# Altium project BLDC_2024.PrjPcb
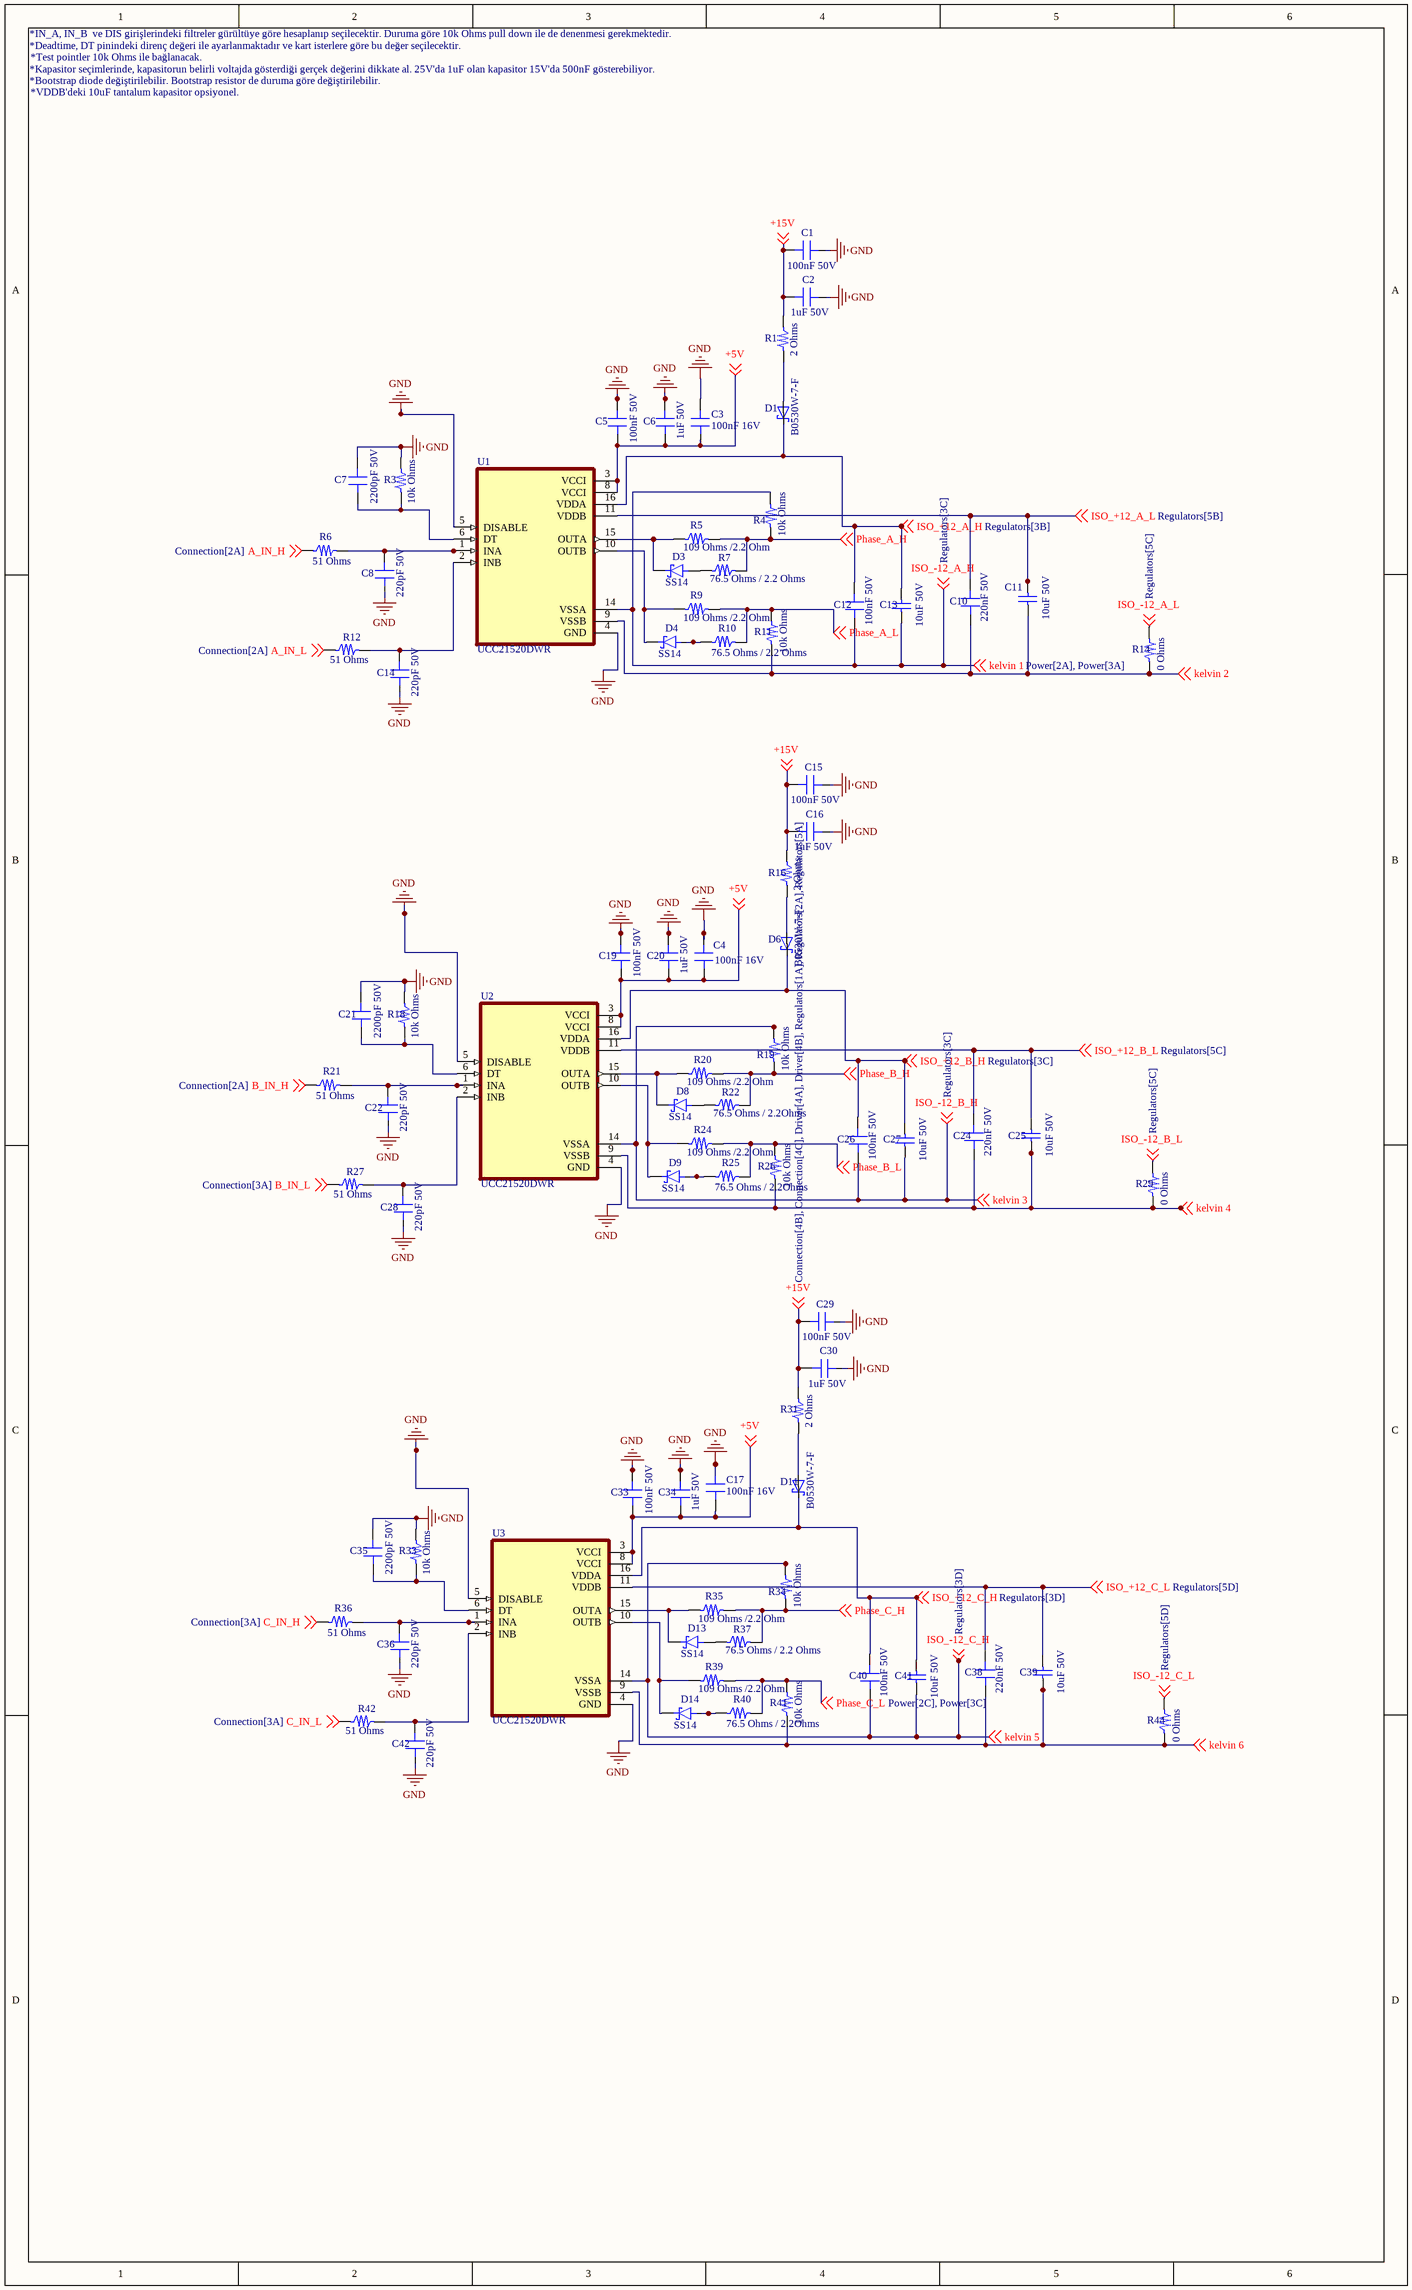
[diagram p0: Driver.SchDoc]
4 sheets, 236 parts. Net scope: flat (ports and power ports of the same name join across sheets).
Board file: PCB3.PcbDoc
Sheets:
  Driver.SchDoc
  Power.SchDoc
  Regulators.SchDoc
  Connection.SchDoc

## Sheet Driver.SchDoc
size 304 x 495 mm; SheetNumber: 1; SheetTotal: 4; SPICEModelCacheATHDNDMS: <root> / <DocumentId>ATHDNDMS</DocumentId> / <CacheFrame Number="0"> / <Model Name="1210_885012009019_2.2nf" Kind="CKT"> / <Text>******* / .subckt 1210_885012009019_2.2nF 1 2 / Rser 1 3 0.0215418747712 / Lser 2 4 2.06777607E-10 / C1 3 4 0.0000000022 / Rpar 3 4 10000000000 / .ends 1210_885012009019_2.2nF</Text> / </Model> / </CacheFrame> / </root>

### Parts
C1  100nF 50V  [0805_CAP]
C2  1uF 50V  [0805_CAP]
C3  100nF 16V  [0805_CAP]
C4  100nF 16V  [0805_CAP]
C5  100nF 50V  [0603_CAP]
C6  1uF 50V  [0603_CAP]
C7  2200pF 50V  [0603_CAP]
C8  220pF 50V  [0603_CAP]
C10  220nF 50V  [0805_CAP]
C11  10uF 50V  [WCAP-CSGP_1210_L3.2W2.5H0.95]
C12  100nF 50V  [0805_CAP]
C13  10uF 50V  [WCAP-CSGP_1210_L3.2W2.5H0.95]
C14  220pF 50V  [0603_CAP]
C15  100nF 50V  [0805_CAP]
C16  1uF 50V  [0805_CAP]
C17  100nF 16V  [0805_CAP]
C19  100nF 50V  [0603_CAP]
C20  1uF 50V  [0603_CAP]
C21  2200pF 50V  [0603_CAP]
C22  220pF 50V  [0603_CAP]
C24  220nF 50V  [0805_CAP]
C25  10uF 50V  [WCAP-CSGP_1210_L3.2W2.5H0.95]
C26  100nF 50V  [0805_CAP]
C27  10uF 50V  [WCAP-CSGP_1210_L3.2W2.5H0.95]
C28  220pF 50V  [0603_CAP]
C29  100nF 50V  [0805_CAP]
C30  1uF 50V  [0805_CAP]
C33  100nF 50V  [0603_CAP]
C34  1uF 50V  [0603_CAP]
C35  2200pF 50V  [0603_CAP]
C36  220pF 50V  [0603_CAP]
C38  220nF 50V  [0805_CAP]
C39  10uF 50V  [WCAP-CSGP_1210_L3.2W2.5H0.95]
C40  100nF 50V  [0805_CAP]
C41  10uF 50V  [WCAP-CSGP_1210_L3.2W2.5H0.95]
C42  220pF 50V  [0603_CAP]
D1  B0530W-7-F  [DO-214AC]
D3  SS14  [SOD3715X145N]
D4  SS14  [SOD3715X145N]
D6  B0530W-7-F  [DO-214AC]
D8  SS14  [SOD3715X145N]
D9  SS14  [SOD3715X145N]
D11  B0530W-7-F  [DO-214AC]
D13  SS14  [SOD3715X145N]
D14  SS14  [SOD3715X145N]
R1  2 Ohms  [0805_RES]
R3  10k Ohms  [0603_RES]
R4  10k Ohms  [0805_RES]
R5  109 Ohms /2.2 Ohm  [0805_RES]
R6  51 Ohms  [0603_RES]
R7  76.5 Ohms / 2.2 Ohms  [0805_RES]
R9  109 Ohms /2.2 Ohm  [0805_RES]
R10  76.5 Ohms / 2.2 Ohms  [0805_RES]
R11  10k Ohms  [0805_RES]
R12  51 Ohms  [0603_RES]
R14  0 Ohms  [0805_RES]
R16  2 Ohms  [0805_RES]
R18  10k Ohms  [0603_RES]
R19  10k Ohms  [0805_RES]
R20  109 Ohms /2.2 Ohm  [0805_RES]
R21  51 Ohms  [0603_RES]
R22  76.5 Ohms / 2.2Ohms  [0805_RES]
R24  109 Ohms /2.2 Ohm  [0805_RES]
R25  76.5 Ohms / 2.2Ohms  [0805_RES]
R26  10k Ohms  [0805_RES]
R27  51 Ohms  [0603_RES]
R29  0 Ohms  [0805_RES]
R31  2 Ohms  [0805_RES]
R33  10k Ohms  [0603_RES]
R34  10k Ohms  [0805_RES]
R35  109 Ohms /2.2 Ohm  [0805_RES]
R36  51 Ohms  [0603_RES]
R37  76.5 Ohms / 2.2 Ohms  [0805_RES]
R39  109 Ohms /2.2 Ohm  [0805_RES]
R40  76.5 Ohms / 2.2Ohms  [0805_RES]
R41  10k Ohms  [0805_RES]
R42  51 Ohms  [0603_RES]
R44  0 Ohms  [0805_RES]
U1  UCC21520DWR  [SOIC127P1030X265-16N]
U2  UCC21520DWR  [SOIC127P1030X265-16N]
U3  UCC21520DWR  [SOIC127P1030X265-16N]

### Nets
GND: C1.1 C2.1 C3.1 C4.1 C5.1 C6.1 C7.2 C8.1 C14.1 C15.1 C16.1 C17.1 C19.1 C20.1 C21.2 C22.1 C28.1 C29.1 C30.1 C33.1 C34.1 C35.2 C36.1 C42.1 R3.2 R18.2 R33.2 U1.4(GND) U1.5(DISABLE) U2.4(GND) U2.5(DISABLE) U3.4(GND) U3.5(DISABLE)
+5V: C3.2 C4.2 C5.2 C6.2 C17.2 C19.2 C20.2 C33.2 C34.2 U1.3(VCCI) U1.8(VCCI) U2.3(VCCI) U2.8(VCCI) U3.3(VCCI) U3.8(VCCI) ; off-sheet +5V
+15V: C1.2 C2.2 C15.2 C16.2 C29.2 C30.2 R1.2 R16.2 R31.2 ; off-sheet +15V
A_IN_H: R6.1 ; off-sheet A_IN_H
A_IN_L: R12.1 ; off-sheet A_IN_L
B_IN_H: R21.1 ; off-sheet B_IN_H
B_IN_L: R27.1 ; off-sheet B_IN_L
C_IN_H: R36.1 ; off-sheet C_IN_H
C_IN_L: R42.1 ; off-sheet C_IN_L
ISO_+12_A_H: C12.1 C13.2 D1.K U1.16(VDDA) ; off-sheet ISO_+12_A_H
ISO_+12_A_L: C10.1 C11.2 U1.11(VDDB) ; off-sheet ISO_+12_A_L
ISO_+12_B_H: C26.1 C27.2 D6.K U2.16(VDDA) ; off-sheet ISO_+12_B_H
ISO_+12_B_L: C24.1 C25.2 U2.11(VDDB) ; off-sheet ISO_+12_B_L
ISO_+12_C_H: C40.1 C41.2 D11.K U3.16(VDDA) ; off-sheet ISO_+12_C_H
ISO_+12_C_L: C38.1 C39.2 U3.11(VDDB) ; off-sheet ISO_+12_C_L
ISO_-12_A_H: C12.2 C13.1 R4.1 U1.14(VSSA) ; off-sheet ISO_-12_A_H, off-sheet kelvin 1  [also labelled kelvin 1]
ISO_-12_A_L: R14.1 ; off-sheet ISO_-12_A_L
ISO_-12_B_H: C26.2 C27.1 R19.1 U2.14(VSSA) ; off-sheet ISO_-12_B_H, off-sheet kelvin 3  [also labelled kelvin 3]
ISO_-12_B_L: R29.1 ; off-sheet ISO_-12_B_L
ISO_-12_C_H: C40.2 C41.1 R34.1 U3.14(VSSA) ; off-sheet ISO_-12_C_H, off-sheet kelvin 5  [also labelled kelvin 5]
ISO_-12_C_L: R44.1 ; off-sheet ISO_-12_C_L
kelvin 2: C10.2 C11.1 R11.2 R14.2 U1.9(VSSB) ; off-sheet kelvin 2
kelvin 4: C24.2 C25.1 R26.2 R29.2 U2.9(VSSB) ; off-sheet kelvin 4
kelvin 6: C38.2 C39.1 R41.2 R44.2 U3.9(VSSB) ; off-sheet kelvin 6
Phase_A_H: R4.2 R5.2 R7.2 ; off-sheet Phase_A_H
Phase_A_L: R9.2 R10.2 R11.1 ; off-sheet Phase_A_L
Phase_B_H: R19.2 R20.2 R22.2 ; off-sheet Phase_B_H
Phase_B_L: R24.2 R25.2 R26.1 ; off-sheet Phase_B_L
Phase_C_H: R34.2 R35.2 R37.2 ; off-sheet Phase_C_H
Phase_C_L: R39.2 R40.2 R41.1 ; off-sheet Phase_C_L
NetC7_1: C7.1 R3.1 U1.6(DT)
NetC8_2: C8.2 R6.2 U1.1(INA)
NetC14_2: C14.2 R12.2 U1.2(INB)
NetC21_1: C21.1 R18.1 U2.6(DT)
NetC22_2: C22.2 R21.2 U2.1(INA)
NetC28_2: C28.2 R27.2 U2.2(INB)
NetC35_1: C35.1 R33.1 U3.6(DT)
NetC36_2: C36.2 R36.2 U3.1(INA)
NetC42_2: C42.2 R42.2 U3.2(INB)
NetD1_A: D1.A R1.1
NetD3_A: D3.A R7.1
NetD3_C: D3.C R5.1 U1.15(OUTA)
NetD4_A: D4.A R10.1
NetD4_C: D4.C R9.1 U1.10(OUTB)
NetD6_A: D6.A R16.1
NetD8_A: D8.A R22.1
NetD8_C: D8.C R20.1 U2.15(OUTA)
NetD9_A: D9.A R25.1
NetD9_C: D9.C R24.1 U2.10(OUTB)
NetD11_A: D11.A R31.1
NetD13_A: D13.A R37.1
NetD13_C: D13.C R35.1 U3.15(OUTA)
NetD14_A: D14.A R40.1
NetD14_C: D14.C R39.1 U3.10(OUTB)

### Notes on the sheet
- *IN_A, IN_B  ve DIS girişlerindeki filtreler gürültüye göre hesaplanıp seçilecektir. Duruma göre 10k Ohms pull down ile de denenmesi gerekmektedir.
- *Deadtime, DT pinindeki direnç değeri ile ayarlanmaktadır ve kart isterlere göre bu değer seçilecektir.
- *Kapasitor seçimlerinde, kapasitorun belirli voltajda gösterdiği gerçek değerini dikkate al. 25V'da 1uF olan kapasitor 15V'da 500nF gösterebiliyor.
- *Bootstrap diode değiştirilebilir. Bootstrap resistor de duruma göre değiştirilebilir.
- *Test pointler 10k Ohms ile bağlanacak.
- *VDDB'deki 10uF tantalum kapasitor opsiyonel.

### Library data of the parts
C1 C2 C10 C12 C15 C16 C24 C26 C29 C30 C38 C40 = CAP_0805: Value: 100nF 16V
C3 C4 C17 = CAP_0805: Value: 100nF 16V
C5-C8 C14 C19-C22 C28 C33-C36 C42 = CAP_0603: CL10B105KO8NNNC - MLCC (1608) 0603 1uF 16VDC ±10% X7R; Value: 1uF 16V
C11 C13 C25 C27 C39 C41 = 885012009019: WCAP-CSGP Multilayer Ceramic Chip Capacitor, General Purpose, size 1210, NP0, 2.2nF, 50V; Manufacturer: Wurth Elektronik; Case/Size Code: 1210; Capacitance Tolerance: +/-5%; Insulation Resistance: 10GΩ; Q Factor: 1000; Technical Reference: NP01210222J050DFCT10000; Manufacturer Part Number: 885012009019; Category: Multilayer Ceramic Chip Capacitors; Match Code: WCAP-CSGP; ComponentLink1Description: Website Link; ComponentLink1URL: https://www.we-online.com/redexpert/article/885012009019?ad; ComponentLink2Description: Datasheet Link; ComponentLink2URL: https://www.we-online.com/redexpert/spec/885012009019?ad; Mount: Surface Mount; Min Operating Temperature: -55°C; Max Operating Temperature: 125°C; Packaging: Tape and Reel; Length: 3.2mm; Width: 2.5mm; Height: 0.95mm; Capacitance: 2.2nF; Ceramic Type: NP0; Rated Voltage (DC): 50V
D1 D6 D11 = SS14: Diode Schottky 40 V 1A Surface Mount DO-214AC (SMA); MF: ON Semiconductor; SnapEDA_Link: https://www.snapeda.com/parts/SS14/Onsemi/view-part/?ref=snap; Package: SMA-2 ON Semiconductor; Value: *; MP: SS14; Check_prices: https://www.snapeda.com/parts/SS14/Onsemi/view-part/?ref=eda
D3 D4 D8 D9 D13 D14 = B0530W-7-F: Diode Schottky 30V 500mA Surface Mount SOD-123; MF: Diodes Inc.; MP: B0530W-7-F; Availability: Unavailable; SnapEDA_Link: https://www.snapeda.com/parts/B0530W-7-F/Diodes%20Inc./view-part/272168/?ref=snap; Package: SOD-123 Diodes Inc.; Value: *; Price: None
R1 R4 R5 R7 R9-R11 R14 R16 R19 R20 R22 R24-R26 R29 R31 R34 R35 R37 R39-R41 R44 = RES_0805: 0805; Value: 1k Ohms; Power: 1/8 W
R3 R6 R12 R18 R21 R27 R33 R36 R42 = 1k Ohms
U1-U3 = UCC21520DWR: 5.7kVrms, 4A/6A dual-channel isolated gate driver w/ dual input, disable pin, 8V UVLO in DW package; MF: Texas Instruments; Check_prices: https://www.snapeda.com/parts/UCC21520DWR/Texas+Instruments/view-part/?ref=eda; Package: SOIC-16 Texas Instruments; Value: *; MP: UCC21520DWR; Price: None; Availability: In Stock; SnapEDA_Link: https://www.snapeda.com/parts/UCC21520DWR/Texas+Instruments/view-part/?ref=snap; Purchase-URL: https://pricing.snapeda.com/search/part/UCC21520DWR/?ref=eda

## Sheet Power.SchDoc
size C; SheetNumber: 2; SheetTotal: 4; SPICEModelCacheAHAYLSHJ: <root> / <DocumentId>AHAYLSHJ</DocumentId> / <CacheFrame Number="0"> / <Model Name="1210_885012109007_47uf" Kind="CKT"> / <Text>******* / .subckt 1210_885012109007_47uF 1 2 / Rser 1 3 0.00210105515092 / Lser 2 4 0.0000000009 / C1 3 4 0.000047 / Rpar 3 4 1000000 / .ends 1210_885012109007_47uF</Text> / </Model> / <Model Name="860040881012_470uf" Kind="CKT"> / <Text>******* / .subckt 860040881012_470uF 1 2 / Rser 1 3 0.04 / Lser 2 4 0.000000009 / C1 3 4 0.00047 / Rpar 3 4 212765.957446809 / .ends 860040881012_470uF</Text> / </Model> / </CacheFrame> / </root>
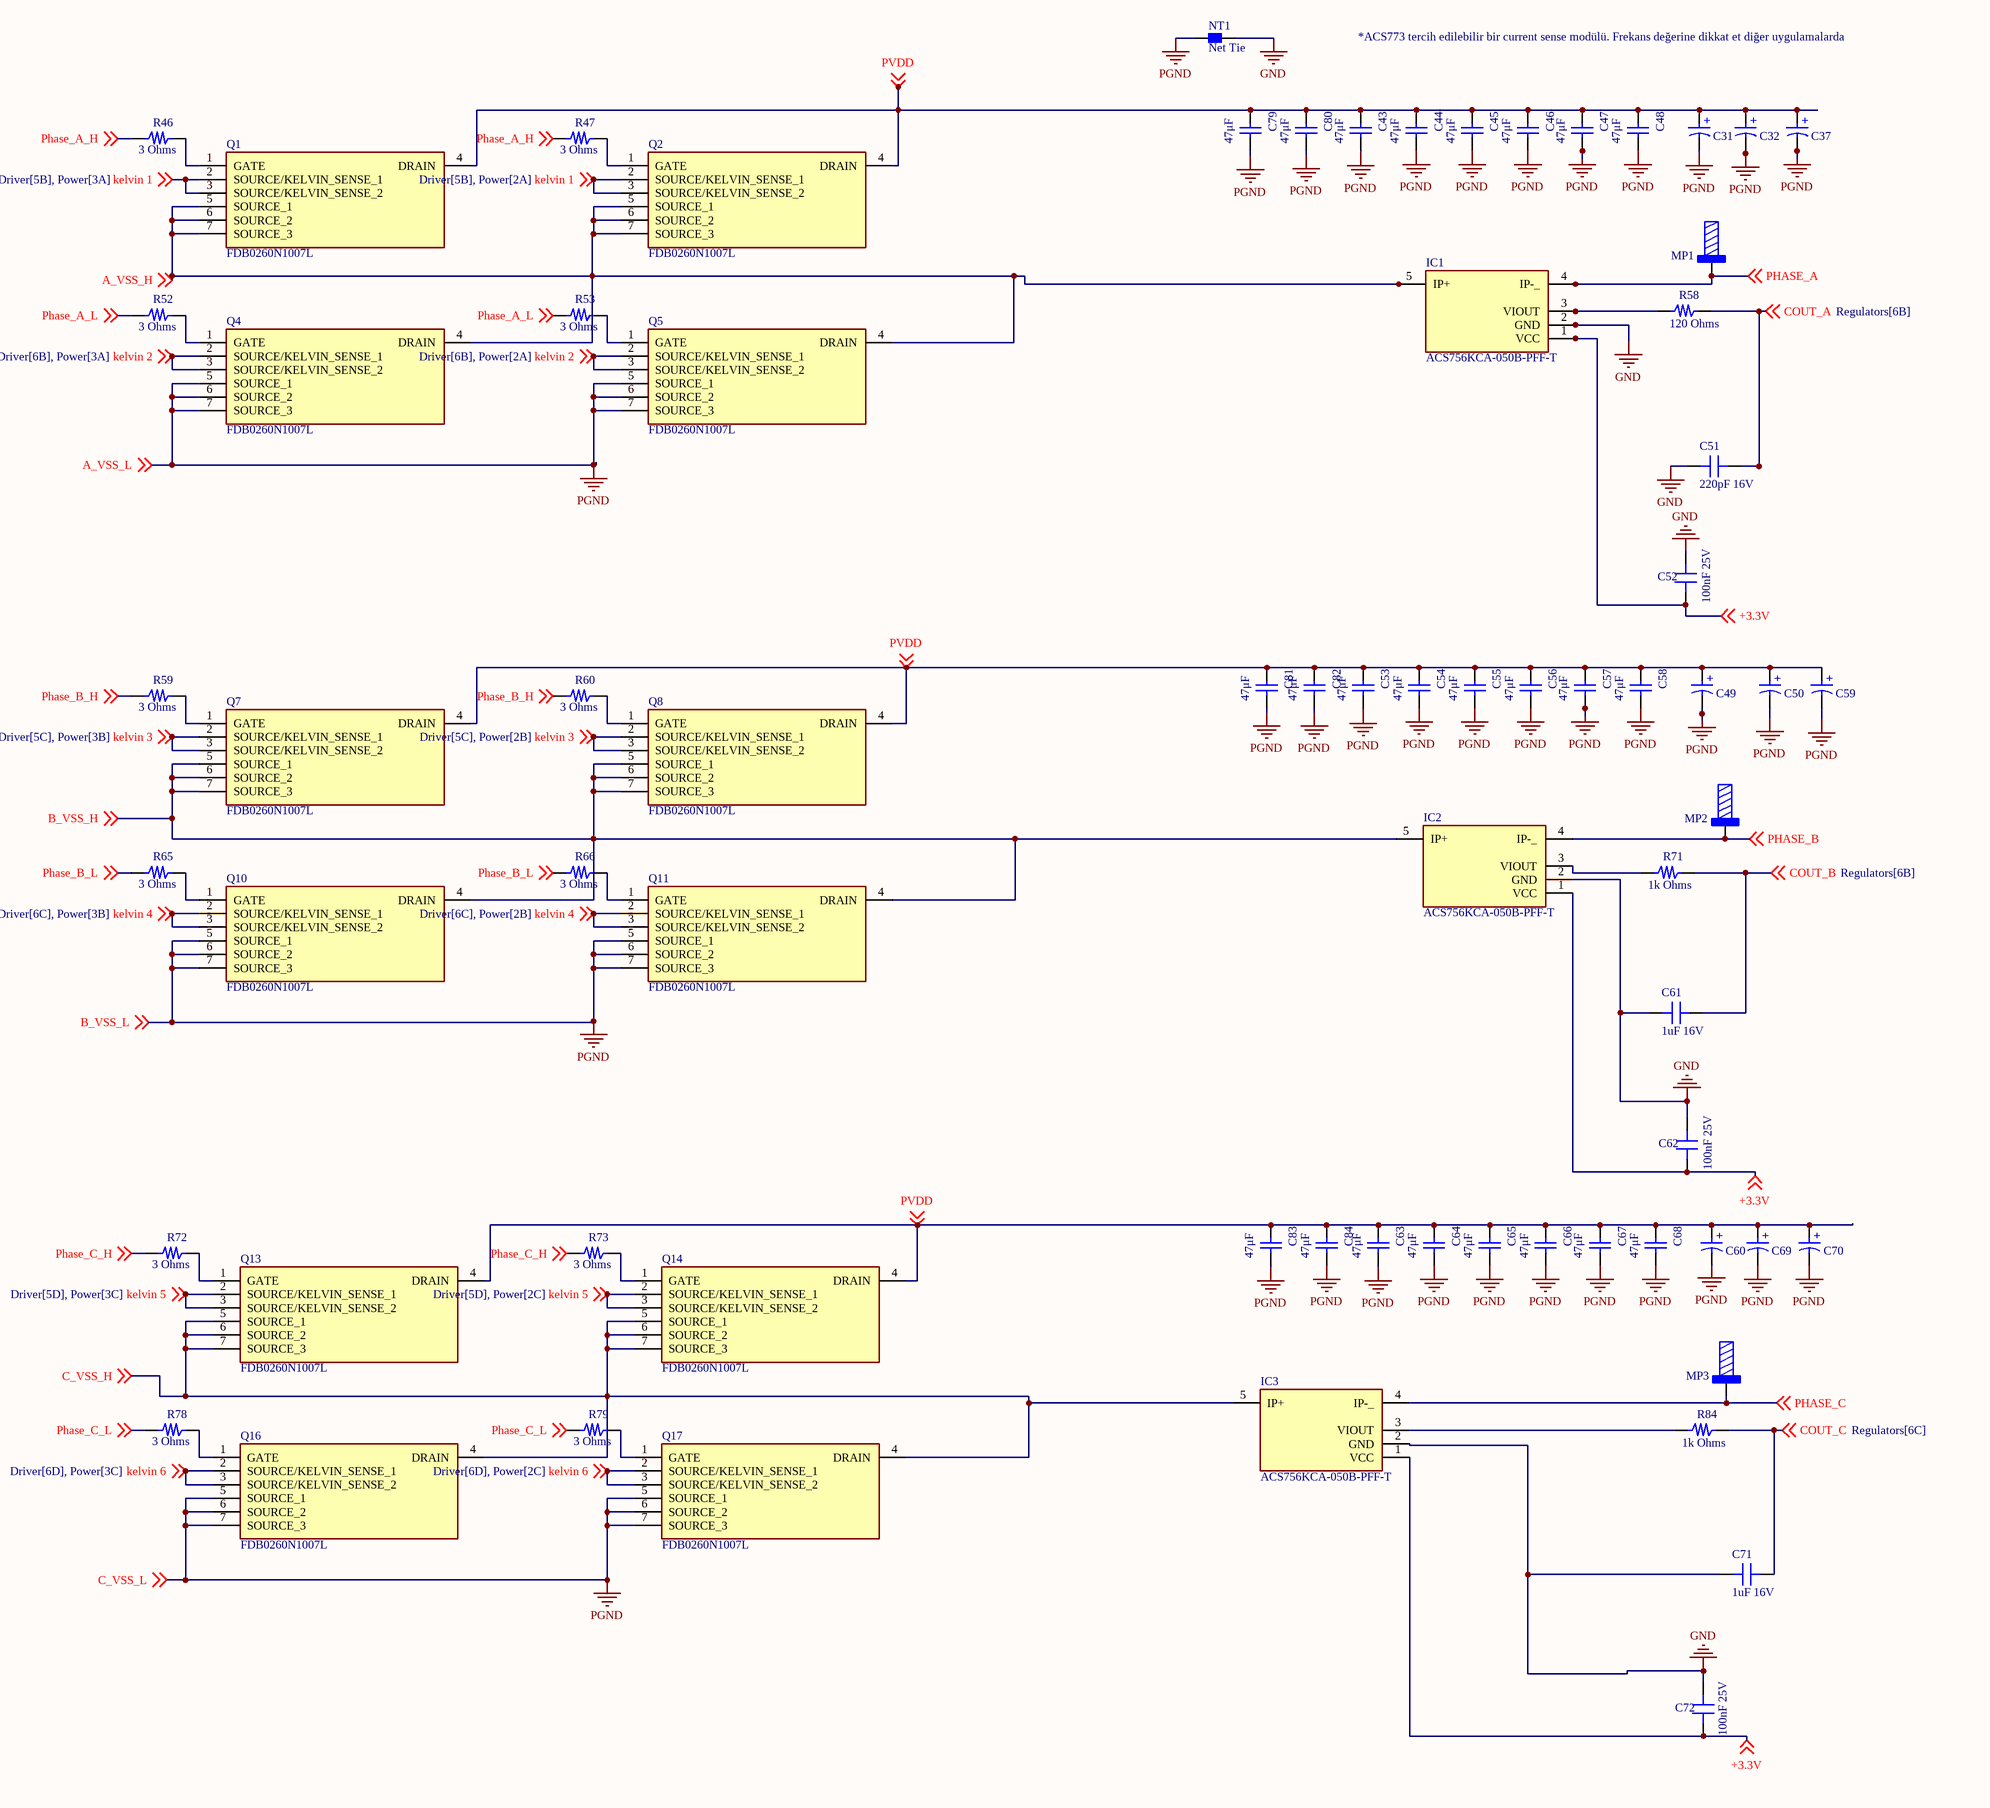
[diagram p1: Power.SchDoc]

### Parts
C31  470µF  [WCAP-ATUL_D18H31.5]  (value not drawn)
C32  470µF  [WCAP-ATUL_D18H31.5]  (value not drawn)
C37  470µF  [WCAP-ATUL_D18H31.5]  (value not drawn)
C43  47μF  [WCAP-CSGP_1210_L3.2W2.5H2.5]
C44  47μF  [WCAP-CSGP_1210_L3.2W2.5H2.5]
C45  47μF  [WCAP-CSGP_1210_L3.2W2.5H2.5]
C46  47μF  [WCAP-CSGP_1210_L3.2W2.5H2.5]
C47  47μF  [WCAP-CSGP_1210_L3.2W2.5H2.5]
C48  47μF  [WCAP-CSGP_1210_L3.2W2.5H2.5]
C49  470µF  [WCAP-ATUL_D18H31.5]  (value not drawn)
C50  470µF  [WCAP-ATUL_D18H31.5]  (value not drawn)
C51  220pF 16V  [0603_CAP]
C52  100nF 25V  [0603_CAP]
C53  47μF  [WCAP-CSGP_1210_L3.2W2.5H2.5]
C54  47μF  [WCAP-CSGP_1210_L3.2W2.5H2.5]
C55  47μF  [WCAP-CSGP_1210_L3.2W2.5H2.5]
C56  47μF  [WCAP-CSGP_1210_L3.2W2.5H2.5]
C57  47μF  [WCAP-CSGP_1210_L3.2W2.5H2.5]
C58  47μF  [WCAP-CSGP_1210_L3.2W2.5H2.5]
C59  470µF  [WCAP-ATUL_D18H31.5]  (value not drawn)
C60  470µF  [WCAP-ATUL_D18H31.5]  (value not drawn)
C61  1uF 16V  [0603_CAP]
C62  100nF 25V  [0603_CAP]
C63  47μF  [WCAP-CSGP_1210_L3.2W2.5H2.5]
C64  47μF  [WCAP-CSGP_1210_L3.2W2.5H2.5]
C65  47μF  [WCAP-CSGP_1210_L3.2W2.5H2.5]
C66  47μF  [WCAP-CSGP_1210_L3.2W2.5H2.5]
C67  47μF  [WCAP-CSGP_1210_L3.2W2.5H2.5]
C68  47μF  [WCAP-CSGP_1210_L3.2W2.5H2.5]
C69  470µF  [WCAP-ATUL_D18H31.5]  (value not drawn)
C70  470µF  [WCAP-ATUL_D18H31.5]  (value not drawn)
C71  1uF 16V  [0603_CAP]
C72  100nF 25V  [0603_CAP]
C79  47μF  [WCAP-CSGP_1210_L3.2W2.5H2.5]
C80  47μF  [WCAP-CSGP_1210_L3.2W2.5H2.5]
C81  47μF  [WCAP-CSGP_1210_L3.2W2.5H2.5]
C82  47μF  [WCAP-CSGP_1210_L3.2W2.5H2.5]
C83  47μF  [WCAP-CSGP_1210_L3.2W2.5H2.5]
C84  47μF  [WCAP-CSGP_1210_L3.2W2.5H2.5]
IC1  ACS756KCA-050B-PFF-T  [ACS758]
IC2  ACS756KCA-050B-PFF-T  [ACS758]
IC3  ACS756KCA-050B-PFF-T  [ACS758]
MP1  M6 x 10mm  [7461098_chemical surface]  (value not drawn)
MP2  M6 x 10mm  [7461098_chemical surface]  (value not drawn)
MP3  M6 x 10mm  [7461098_chemical surface]  (value not drawn)
NT1  Net Tie  [NET TIE]  (net tie, no BOM)
Q1  FDB0260N1007L  [FDB0260N1007L]
Q2  FDB0260N1007L  [FDB0260N1007L]
Q4  FDB0260N1007L  [FDB0260N1007L]
Q5  FDB0260N1007L  [FDB0260N1007L]
Q7  FDB0260N1007L  [FDB0260N1007L]
Q8  FDB0260N1007L  [FDB0260N1007L]
Q10  FDB0260N1007L  [FDB0260N1007L]
Q11  FDB0260N1007L  [FDB0260N1007L]
Q13  FDB0260N1007L  [FDB0260N1007L]
Q14  FDB0260N1007L  [FDB0260N1007L]
Q16  FDB0260N1007L  [FDB0260N1007L]
Q17  FDB0260N1007L  [FDB0260N1007L]
R46  3 Ohms  [0805_RES]
R47  3 Ohms  [0805_RES]
R52  3 Ohms  [0805_RES]
R53  3 Ohms  [0805_RES]
R58  120 Ohms  [0603_RES]
R59  3 Ohms  [0805_RES]
R60  3 Ohms  [0805_RES]
R65  3 Ohms  [0805_RES]
R66  3 Ohms  [0805_RES]
R71  1k Ohms  [0603_RES]
R72  3 Ohms  [0805_RES]
R73  3 Ohms  [0805_RES]
R78  3 Ohms  [0805_RES]
R79  3 Ohms  [0805_RES]
R84  1k Ohms  [0603_RES]

### Nets
GND: C51.1 C52.2 C61.1 C62.2 C71.1 C72.2 IC1.2(GND) IC2.2(GND) IC3.2(GND) NT1.2
PGND: C31.2(N) C32.2(N) C37.2(N) C43.2 C44.2 C45.2 C46.2 C47.2 C48.2 C49.2(N) C50.2(N) C53.2 C54.2 C55.2 C56.2 C57.2 C58.2 C59.2(N) C60.2(N) C63.2 C64.2 C65.2 C66.2 C67.2 C68.2 C69.2(N) C70.2(N) C79.2 C80.2 C81.2 C82.2 C83.2 C84.2 NT1.1 Q4.5(SOURCE_1) Q4.6(SOURCE_2) Q4.7(SOURCE_3) Q5.5(SOURCE_1) Q5.6(SOURCE_2) Q5.7(SOURCE_3) Q10.5(SOURCE_1) Q10.6(SOURCE_2) Q10.7(SOURCE_3) Q11.5(SOURCE_1) Q11.6(SOURCE_2) Q11.7(SOURCE_3) Q16.5(SOURCE_1) Q16.6(SOURCE_2) Q16.7(SOURCE_3) Q17.5(SOURCE_1) Q17.6(SOURCE_2) Q17.7(SOURCE_3) ; off-sheet A_VSS_L, off-sheet B_VSS_L, off-sheet C_VSS_L  [also labelled A_VSS_L, B_VSS_L, C_VSS_L]
+3.3V: C52.1 C62.1 C72.1 IC1.1(VCC) IC2.1(VCC) IC3.1(VCC) ; off-sheet +3.3V
A_VSS_H: IC1.5(IP+) Q1.5(SOURCE_1) Q1.6(SOURCE_2) Q1.7(SOURCE_3) Q2.5(SOURCE_1) Q2.6(SOURCE_2) Q2.7(SOURCE_3) Q4.4(DRAIN) Q5.4(DRAIN) ; off-sheet A_VSS_H
B_VSS_H: IC2.5(IP+) Q7.5(SOURCE_1) Q7.6(SOURCE_2) Q7.7(SOURCE_3) Q8.5(SOURCE_1) Q8.6(SOURCE_2) Q8.7(SOURCE_3) Q10.4(DRAIN) Q11.4(DRAIN) ; off-sheet B_VSS_H
C_VSS_H: IC3.5(IP+) Q13.5(SOURCE_1) Q13.6(SOURCE_2) Q13.7(SOURCE_3) Q14.5(SOURCE_1) Q14.6(SOURCE_2) Q14.7(SOURCE_3) Q16.4(DRAIN) Q17.4(DRAIN) ; off-sheet C_VSS_H
COUT_A: C51.2 R58.2 ; off-sheet COUT_A
COUT_B: C61.2 R71.2 ; off-sheet COUT_B
COUT_C: C71.2 R84.2 ; off-sheet COUT_C
kelvin 1: Q1.2(SOURCE/KELVIN_SENSE_1) Q1.3(SOURCE/KELVIN_SENSE_2) Q2.2(SOURCE/KELVIN_SENSE_1) Q2.3(SOURCE/KELVIN_SENSE_2) ; off-sheet kelvin 1  [project net ISO_-12_A_H]
kelvin 2: Q4.2(SOURCE/KELVIN_SENSE_1) Q4.3(SOURCE/KELVIN_SENSE_2) Q5.2(SOURCE/KELVIN_SENSE_1) Q5.3(SOURCE/KELVIN_SENSE_2) ; off-sheet kelvin 2
kelvin 3: Q7.2(SOURCE/KELVIN_SENSE_1) Q7.3(SOURCE/KELVIN_SENSE_2) Q8.2(SOURCE/KELVIN_SENSE_1) Q8.3(SOURCE/KELVIN_SENSE_2) ; off-sheet kelvin 3  [project net ISO_-12_B_H]
kelvin 4: Q10.2(SOURCE/KELVIN_SENSE_1) Q10.3(SOURCE/KELVIN_SENSE_2) Q11.2(SOURCE/KELVIN_SENSE_1) Q11.3(SOURCE/KELVIN_SENSE_2) ; off-sheet kelvin 4
kelvin 5: Q13.2(SOURCE/KELVIN_SENSE_1) Q13.3(SOURCE/KELVIN_SENSE_2) Q14.2(SOURCE/KELVIN_SENSE_1) Q14.3(SOURCE/KELVIN_SENSE_2) ; off-sheet kelvin 5  [project net ISO_-12_C_H]
kelvin 6: Q16.2(SOURCE/KELVIN_SENSE_1) Q16.3(SOURCE/KELVIN_SENSE_2) Q17.2(SOURCE/KELVIN_SENSE_1) Q17.3(SOURCE/KELVIN_SENSE_2) ; off-sheet kelvin 6
PHASE_A: IC1.4(IP-_) MP1.1 ; off-sheet PHASE_A
Phase_A_H: R46.1 R47.1 ; off-sheet Phase_A_H
Phase_A_L: R52.1 R53.1 ; off-sheet Phase_A_L
PHASE_B: IC2.4(IP-_) MP2.1 ; off-sheet PHASE_B
Phase_B_H: R59.1 R60.1 ; off-sheet Phase_B_H
Phase_B_L: R65.1 R66.1 ; off-sheet Phase_B_L
PHASE_C: IC3.4(IP-_) MP3.1 ; off-sheet PHASE_C
Phase_C_H: R72.1 R73.1 ; off-sheet Phase_C_H
Phase_C_L: R78.1 R79.1 ; off-sheet Phase_C_L
PVDD: C31.1(P) C32.1(P) C37.1(P) C43.1 C44.1 C45.1 C46.1 C47.1 C48.1 C49.1(P) C50.1(P) C53.1 C54.1 C55.1 C56.1 C57.1 C58.1 C59.1(P) C60.1(P) C63.1 C64.1 C65.1 C66.1 C67.1 C68.1 C69.1(P) C70.1(P) C79.1 C80.1 C81.1 C82.1 C83.1 C84.1 Q1.4(DRAIN) Q2.4(DRAIN) Q7.4(DRAIN) Q8.4(DRAIN) Q13.4(DRAIN) Q14.4(DRAIN) ; off-sheet PVDD
NetIC1_3: IC1.3(VIOUT) R58.1
NetIC2_3: IC2.3(VIOUT) R71.1
NetIC3_3: IC3.3(VIOUT) R84.1
NetQ1_1: Q1.1(GATE) R46.2
NetQ2_1: Q2.1(GATE) R47.2
NetQ4_1: Q4.1(GATE) R52.2
NetQ5_1: Q5.1(GATE) R53.2
NetQ7_1: Q7.1(GATE) R59.2
NetQ8_1: Q8.1(GATE) R60.2
NetQ10_1: Q10.1(GATE) R65.2
NetQ11_1: Q11.1(GATE) R66.2
NetQ13_1: Q13.1(GATE) R72.2
NetQ14_1: Q14.1(GATE) R73.2
NetQ16_1: Q16.1(GATE) R78.2
NetQ17_1: Q17.1(GATE) R79.2

### Notes on the sheet
- *ACS773 tercih edilebilir bir current sense modülü. Frekans değerine dikkat et diğer uygulamalarda
- (in symbol 860040881012) +

### Library data of the parts
C31 C32 C37 C49 C50 C59 C60 C69 C70 = 860040881012: WCAP-ATUL Aluminum Electrolytic Capacitor, Radial, THT, D18 x H31.5mm, 470µF, 100V; Manufacturer: Wurth Elektronik; Capacitance Tolerance: 20%; Dissipation Factor: 9%; Endurance: 10000h; Leakage Current: 470µA; Ripple Current: 1600mA; Technical Reference: ATDL315471M100DSPAEK000; Manufacturer Part Number: 860040881012; Category: Aluminum Electrolytic Capacitors; Match Code: WCAP-ATUL; ComponentLink1Description: Website Link; ComponentLink1URL: https://www.we-online.com/redexpert/article/860040881012?ad; ComponentLink2Description: Datasheet Link; ComponentLink2URL: https://www.we-online.com/redexpert/spec/860040881012?ad; Mount: Through Hole; Operating Temperature Max: 105°C; Operating Temperature Min: -40°C; Packaging: Ammo Pack; Height: 31.5mm; Diameter: 18mm; Capacitance: 470µF; Rated Voltage (DC): 100V
C43-C48 C53-C58 C63-C68 C79-C84 = 885012109007: WCAP-CSGP Multilayer Ceramic Chip Capacitor, General Purpose, size 1210, X5R, 47μF, 10V; Manufacturer: Wurth Elektronik; Case/Size Code: 1210; Capacitance Tolerance: +/-20%; Dissipation Factor: 10%; Insulation Resistance: 0.002GΩ; Technical Reference: X5R1210476M010DFCT10000; Manufacturer Part Number: 885012109007; Category: Multilayer Ceramic Chip Capacitors; Match Code: WCAP-CSGP; ComponentLink1Description: Website Link; ComponentLink1URL: https://www.we-online.com/redexpert/article/885012109007?ad; ComponentLink2Description: Datasheet Link; ComponentLink2URL: https://www.we-online.com/redexpert/spec/885012109007?ad; Mount: Surface Mount; Min Operating Temperature: -55°C; Max Operating Temperature: 85°C; Packaging: Tape and Reel; Length: 3.2mm; Width: 2.5mm; Height: 2.5mm; Capacitance: 47μF; Ceramic Type: X5R; Rated Voltage (DC): 10V
C51 C61 C71 = CAP_0603: CL10B105KO8NNNC - MLCC (1608) 0603 1uF 16VDC ±10% X7R
  C51: Value: 220pF 16V
  C61 C71: Value: 1uF 16V
C52 C62 C72 = CAP_0603: as C5 on sheet Driver
IC1-IC3 = ACS756KCA-050B-PFF-T: Integrated Circuit; Manufacturer_Name: Allegro Microsystems; Datasheet Link: https://www.allegromicro.com/~/media/Files/Datasheets/ACS756-Datasheet.ashx; Height: 7.1mm; Manufacturer_Part_Number: ACS756KCA-050B-PFF-T; Arrow Part Number: ACS756KCA-050B-PFF-T; Arrow Price/Stock: https://www.arrow.com/en/products/acs756kca-050b-pff-t/allegro-microsystems
MP1-MP3 = 7461098: WP-SHFU REDCUBE PRESS-FIT with external thread, L13W13H15.5mm, M6 x 10mm, 250A; Manufacturer: Wurth Elektronik; Surface: Tin; ComponentLink1Description: Website Link; ComponentLink1URL: https://www.we-online.com/redexpert/article/7461098?ad; ComponentLink2Description: Datasheet Link; ComponentLink2URL: https://www.we-online.com/redexpert/spec/7461098?ad; Manufacturer Part Number: 7461098; Category: REDCUBE PRESS-FIT; Match Code: WP-SHFU; Mount: Press Fit; Operating Temperature Max: 150°C; Operating Temperature Min: -55°C; Packaging: Bulk; Length: 13mm; Width: 13mm; Height: 15.5mm; Material: Brass; Number of Pins: 25; Rated Current: 250A; Thread Length: 10mm; Thread Size: M6
NT1 = Net Tie: 1206 size
Q1 Q2 Q4 Q5 Q7 Q8 Q10 Q11 Q13 Q14 Q16 Q17 = FDB0260N1007L: MOSFET 100V TO263 7L JEDEC GREEN EMC; Manufacturer_Name: onsemi; Geometry.Height: 4.7mm; Manufacturer_Part_Number: FDB0260N1007L; Mouser Part Number: 512-FDB0260N1007L; Mouser Price/Stock: https://www.mouser.co.uk/ProductDetail/ON-Semiconductor-Fairchild/FDB0260N1007L?qs=lDZPRidwxxtoCZGWdM7x%2FA%3D%3D; Arrow Part Number: FDB0260N1007L; Arrow Price/Stock: https://www.arrow.com/en/products/fdb0260n1007l/on-semiconductor; Datasheet Link: https://componentsearchengine.com/Datasheets/2/FDB0260N1007L.pdf
R46 R47 R52 R53 R59 R60 R65 R66 R72 R73 R78 R79 = RES_0805: 0805; Value: 1k Ohms; Power: 1/8 W
R58 = 1k Ohms

## Sheet Regulators.SchDoc
size A3; SheetNumber: 3; SheetTotal: 4; SPICEModelCacheRCVYWZKJ: <root> / <DocumentId>RCVYWZKJ</DocumentId> / <CacheFrame Number="0"> / <Model Name="0805_885012007012_22pf" Kind="CKT"> / <Text>******* / .subckt 0805_885012007012_22pF 1 2 / Rser 1 3 0.353164620745 / Lser 2 4 4.83956508E-10 / C1 3 4 0.000000000022 / Rpar 3 4 10000000000 / .ends 0805_885012007012_22pF</Text> / </Model> / </CacheFrame> / </root>
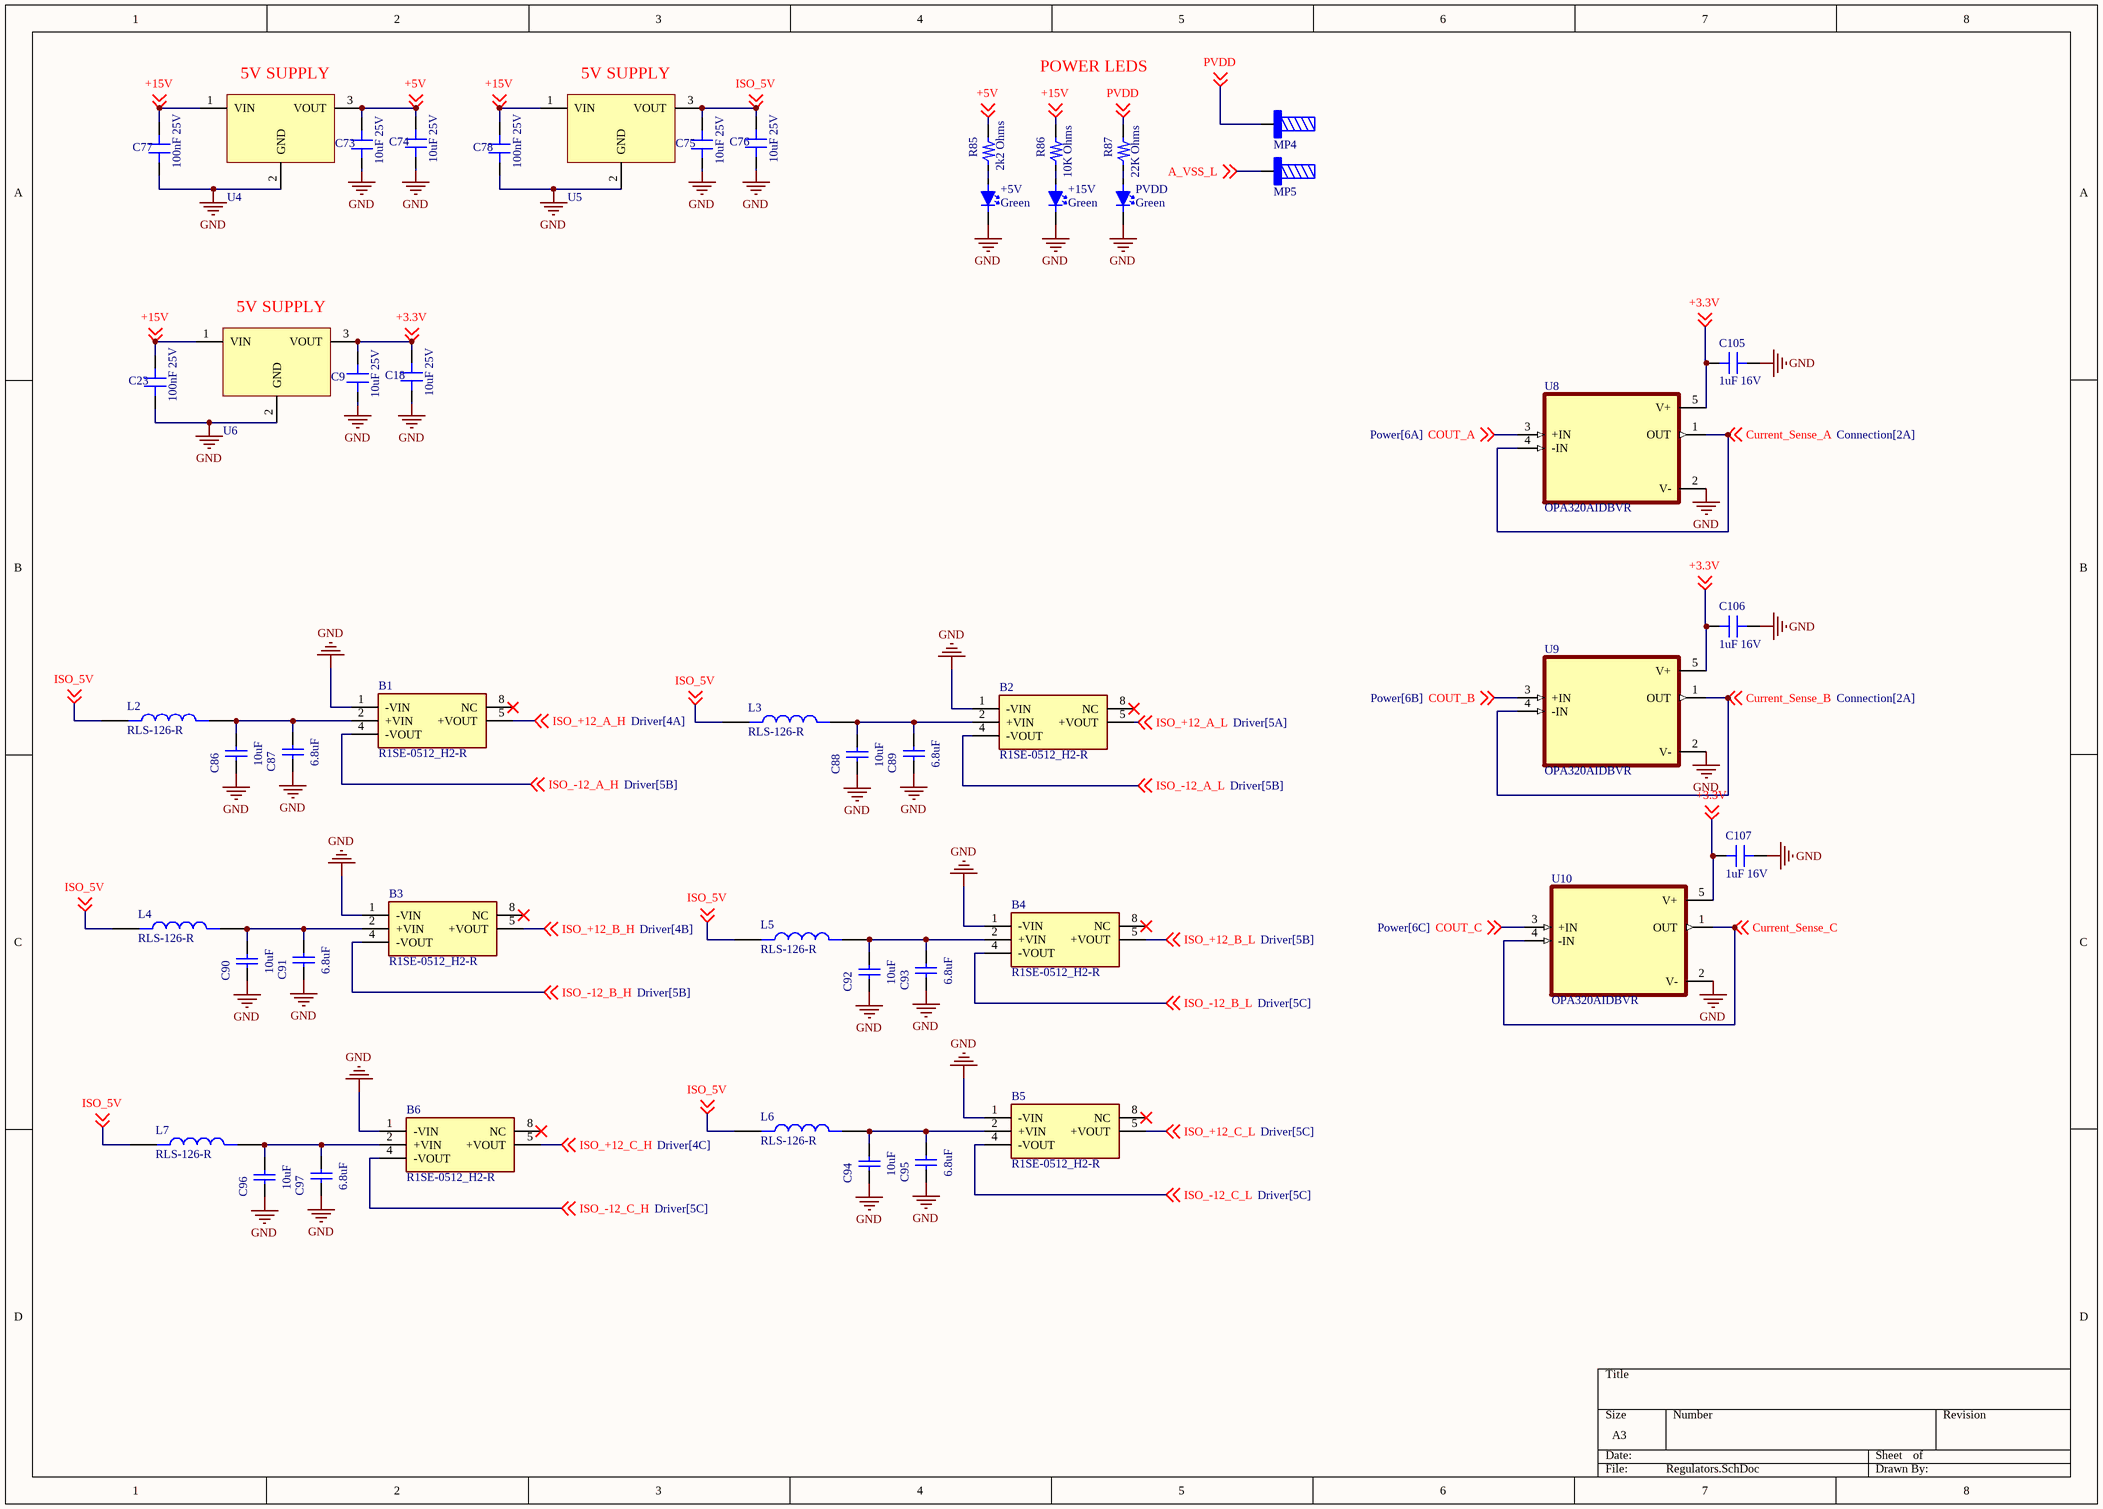
[diagram p2: Regulators.SchDoc]

### Parts
+5V  Green  [0805LED]
+15V  Green  [0805LED]
B1  R1SE-0512_H2-R  [R1SE3305H2R]
B2  R1SE-0512_H2-R  [R1SE3305H2R]
B3  R1SE-0512_H2-R  [R1SE3305H2R]
B4  R1SE-0512_H2-R  [R1SE3305H2R]
B5  R1SE-0512_H2-R  [R1SE3305H2R]
B6  R1SE-0512_H2-R  [R1SE3305H2R]
C9  10uF 25V  [0603_CAP]
C18  10uF 25V  [0603_CAP]
C23  100nF 25V  [0603_CAP]
C73  10uF 25V  [0603_CAP]
C74  10uF 25V  [0603_CAP]
C75  10uF 25V  [0603_CAP]
C76  10uF 25V  [0603_CAP]
C77  100nF 25V  [0603_CAP]
C78  100nF 25V  [0603_CAP]
C86  10uF  [WCAP-CSGP_0805_L2W1.25H0.6_Reflow]
C87  6.8uF  [WCAP-CSGP_0805_L2W1.25H0.6_Reflow]
C88  10uF  [WCAP-CSGP_0805_L2W1.25H0.6_Reflow]
C89  6.8uF  [WCAP-CSGP_0805_L2W1.25H0.6_Reflow]
C90  10uF  [WCAP-CSGP_0805_L2W1.25H0.6_Reflow]
C91  6.8uF  [WCAP-CSGP_0805_L2W1.25H0.6_Reflow]
C92  10uF  [WCAP-CSGP_0805_L2W1.25H0.6_Reflow]
C93  6.8uF  [WCAP-CSGP_0805_L2W1.25H0.6_Reflow]
C94  10uF  [WCAP-CSGP_0805_L2W1.25H0.6_Reflow]
C95  6.8uF  [WCAP-CSGP_0805_L2W1.25H0.6_Reflow]
C96  10uF  [WCAP-CSGP_0805_L2W1.25H0.6_Reflow]
C97  6.8uF  [WCAP-CSGP_0805_L2W1.25H0.6_Reflow]
C105  1uF 16V  [0603_CAP]
C106  1uF 16V  [0603_CAP]
C107  1uF 16V  [0603_CAP]
L2  RLS-126-R  [IND_RLS-126-R]
L3  RLS-126-R  [IND_RLS-126-R]
L4  RLS-126-R  [IND_RLS-126-R]
L5  RLS-126-R  [IND_RLS-126-R]
L6  RLS-126-R  [IND_RLS-126-R]
L7  RLS-126-R  [IND_RLS-126-R]
MP4  M6 x 10mm  [7461098_chemical surface]  (value not drawn)
MP5  M6 x 10mm  [7461098_chemical surface]  (value not drawn)
PVDD  Green  [0805LED]
R85  2k2 Ohms  [0805_RES]
R86  10K Ohms  [0805_RES]
R87  22K Ohms  [0805_RES]
U4  8-28Vin, 5Vout, 1Aout  [WPME-FDSM_SIP-3_L11.6W8.5H10.5]  (value not drawn)
U5  8-28Vin, 5Vout, 1Aout  [WPME-FDSM_SIP-3_L11.6W8.5H10.5]  (value not drawn)
U6  8-28Vin, 5Vout, 1Aout  [WPME-FDSM_SIP-3_L11.6W8.5H10.5]  (value not drawn)
U8  OPA320AIDBVR  [SOT95P280X145-5N]
U9  OPA320AIDBVR  [SOT95P280X145-5N]
U10  OPA320AIDBVR  [SOT95P280X145-5N]

### Nets
A_VSS_L: MP5.1 ; off-sheet A_VSS_L  [project net PGND]
GND: +5V.2(Cathode(-)) +15V.2(Cathode(-)) B1.1(-VIN) B2.1(-VIN) B3.1(-VIN) B4.1(-VIN) B5.1(-VIN) B6.1(-VIN) C9.1 C18.1 C23.1 C73.1 C74.1 C75.1 C76.1 C77.1 C78.1 C86.1 C87.1 C88.1 C89.1 C90.1 C91.1 C92.1 C93.1 C94.1 C95.1 C96.1 C97.1 C105.2 C106.2 C107.2 PVDD.2(Cathode(-)) U4.2(GND) U5.2(GND) U6.2(GND) U8.2(V-) U9.2(V-) U10.2(V-)
+3.3V: C9.2 C18.2 C105.1 C106.1 C107.1 U6.3(VOUT) U8.5(V+) U9.5(V+) U10.5(V+) ; off-sheet +3.3V
+5V: C73.2 C74.2 R85.1 U4.3(VOUT) ; off-sheet +5V
+15V: C23.2 C77.2 C78.2 R86.1 U4.1(VIN) U5.1(VIN) U6.1(VIN) ; off-sheet +15V
COUT_A: U8.3(+IN) ; off-sheet COUT_A
COUT_B: U9.3(+IN) ; off-sheet COUT_B
COUT_C: U10.3(+IN) ; off-sheet COUT_C
Current_Sense_A: U8.1(OUT) U8.4(-IN) ; off-sheet Current_Sense_A
Current_Sense_B: U9.1(OUT) U9.4(-IN) ; off-sheet Current_Sense_B
Current_Sense_C: U10.1(OUT) U10.4(-IN) ; off-sheet Current_Sense_C
ISO_5V: C75.2 C76.2 L2.1 L3.1 L4.1 L5.1 L6.1 L7.1 U5.3(VOUT) ; off-sheet ISO_5V
ISO_+12_A_H: B1.5(+VOUT) ; off-sheet ISO_+12_A_H
ISO_+12_A_L: B2.5(+VOUT) ; off-sheet ISO_+12_A_L
ISO_+12_B_H: B3.5(+VOUT) ; off-sheet ISO_+12_B_H
ISO_+12_B_L: B4.5(+VOUT) ; off-sheet ISO_+12_B_L
ISO_+12_C_H: B6.5(+VOUT) ; off-sheet ISO_+12_C_H
ISO_+12_C_L: B5.5(+VOUT) ; off-sheet ISO_+12_C_L
ISO_-12_A_H: B1.4(-VOUT) ; off-sheet ISO_-12_A_H
ISO_-12_A_L: B2.4(-VOUT) ; off-sheet ISO_-12_A_L
ISO_-12_B_H: B3.4(-VOUT) ; off-sheet ISO_-12_B_H
ISO_-12_B_L: B4.4(-VOUT) ; off-sheet ISO_-12_B_L
ISO_-12_C_H: B6.4(-VOUT) ; off-sheet ISO_-12_C_H
ISO_-12_C_L: B5.4(-VOUT) ; off-sheet ISO_-12_C_L
PVDD: MP4.1 R87.1 ; off-sheet PVDD
Net+5V_1: +5V.1(Anode(+)) R85.2
Net+15V_1: +15V.1(Anode(+)) R86.2
NetB1_2: B1.2(+VIN) C86.2 C87.2 L2.2
NetB2_2: B2.2(+VIN) C88.2 C89.2 L3.2
NetB3_2: B3.2(+VIN) C90.2 C91.2 L4.2
NetB4_2: B4.2(+VIN) C92.2 C93.2 L5.2
NetB5_2: B5.2(+VIN) C94.2 C95.2 L6.2
NetB6_2: B6.2(+VIN) C96.2 C97.2 L7.2
NetPVDD_1: PVDD.1(Anode(+)) R87.2

Not connected (* = marked no-connect by the designer): B1 8(NC)*; B2 8(NC)*; B3 8(NC)*; B4 8(NC)*; B5 8(NC)*; B6 8(NC)*

### Notes on the sheet
- (near U4) 5V SUPPLY
- (near U5) 5V SUPPLY
- POWER LEDS
- (near U6) 5V SUPPLY

### Library data of the parts
+5V +15V PVDD = LED: 0805
B1-B6 = R1SE-0512_H2-R: RECOM POWER - R1SE-0512/H2-R - DC-DC CONVERTER, 12V, 0.084A, SMD; Geometry.Height: 7.5mm; Manufacturer_Name: RECOM Power; Manufacturer_Part_Number: R1SE-0512/H2-R; Mouser Part Number: 919-R1SE-0512/H2-R; Mouser Price/Stock: https://www.mouser.co.uk/ProductDetail/RECOM-Power/R1SE-0512-H2-R?qs=2sV1BwmkawRQ2FXa7NBFcA%3D%3D; Arrow Part Number: R1SE-0512/H2-R; Arrow Price/Stock: https://www.arrow.com/en/products/r1se-0512h2-r/recom-power?region=nac; Datasheet Link: https://componentsearchengine.com/Datasheets/1/R1SE-0512_H2-R.pdf
C9 C18 C23 C73-C78 = CAP_0603: as C5 on sheet Driver
C86-C97 = 885012007012: WCAP-CSGP Multilayer Ceramic Chip Capacitor, General Purpose, size 0805, NP0, 22pF, 16V; Manufacturer: Wurth Elektronik; Case/Size Code: 0805; Capacitance Tolerance: +/-5%; Insulation Resistance: 10GΩ; Q Factor: 840; Technical Reference: NP00805220J016DFCT10000; Manufacturer Part Number: 885012007012; Category: Multilayer Ceramic Chip Capacitors; Match Code: WCAP-CSGP; ComponentLink1Description: Website Link; ComponentLink1URL: https://www.we-online.com/redexpert/article/885012007012?ad; ComponentLink2Description: Datasheet Link; ComponentLink2URL: https://www.we-online.com/redexpert/spec/885012007012?ad; Mount: Surface Mount; Min Operating Temperature: -55°C; Max Operating Temperature: 125°C; Packaging: Tape and Reel; Length: 2mm; Width: 1.25mm; Height: 0.6mm; Capacitance: 22pF; Ceramic Type: NP0; Rated Voltage (DC): 16V
C105-C107 = CAP_0603: as C51 on sheet Power; Value: 1uF 16V
L2-L7 = RLS-126-R: Line Inductors for RECOM Power Supply; SnapEDA_Link: https://www.snapeda.com/parts/RLS-126-R/Recom+Power/view-part/?ref=snap; Package: None; Value: *; MF: Recom Power; MP: RLS-126-R; Check_prices: https://www.snapeda.com/parts/RLS-126-R/Recom+Power/view-part/?ref=eda
MP4 MP5 = 7461098: as MP1 on sheet Power; ComponentLink1Description: Website Link; ComponentLink1URL: https://www.we-online.com/redexpert/article/7461098?ad; ComponentLink2Description: Datasheet Link; ComponentLink2URL: https://www.we-online.com/redexpert/spec/7461098?ad; Manufacturer Part Number: 7461098; Category: REDCUBE PRESS-FIT; Match Code: WP-SHFU; Mount: Press Fit; Operating Temperature Max: 150°C; Operating Temperature Min: -55°C; Packaging: Bulk; Length: 13mm; Width: 13mm; Height: 15.5mm; Material: Brass; Number of Pins: 25; Rated Current: 250A; Thread Length: 10mm; Thread Size: M6
R85-R87 = RES_0805: 0805; Power: 1/8 W
  R85: Value: 2k2 Ohms
  R86: Value: 10K Ohms
  R87: Value: 22K Ohms
U4-U6 = 173010578: WPME-FDSM Fixed Step Down Regulator Module, THT, SIP-3, 8-28Vin, 5Vout, 1Aout; Manufacturer: Wurth Elektronik; Input Voltage Min: 8V; Input Voltage Max: 28V; Output Current: 1A; Output Voltage: 5V; Manufacturer Part Number: 173010578; Category: Step Down Converter; Match Code: WPME-FDSM; ComponentLink1Description: Website Link; ComponentLink1URL: https://www.we-online.com/redexpert/article/173010578?ad; ComponentLink2Description: Datasheet Link; ComponentLink2URL: https://www.we-online.com/redexpert/spec/173010578?ad; Mount: Through Hole; Operating Temperature Max: 85°C; Operating Temperature Min: -40°C; Packaging: Tube; Case/Size Code: SIP-3; Length: 11.6mm; Width: 8.5mm; Height: 10.5mm
U8-U10 = OPA320AIDBVR: Precision, zero-crossover, 20-MHz, 0.9-pA Ib, RRIO, CMOS operational amplifier; MF: Texas Instruments; Availability: In Stock; SnapEDA_Link: https://www.snapeda.com/parts/OPA320AIDBVR/Texas+Instruments/view-part/?ref=snap; Price: None; Check_prices: https://www.snapeda.com/parts/OPA320AIDBVR/Texas+Instruments/view-part/?ref=eda; Package: SOT-23-5 Texas Instruments; MP: OPA320AIDBVR; Value: *; Purchase-URL: https://pricing.snapeda.com/search/part/OPA320AIDBVR/?ref=eda

## Sheet Connection.SchDoc
size A4; SheetNumber: 4; SheetTotal: 4
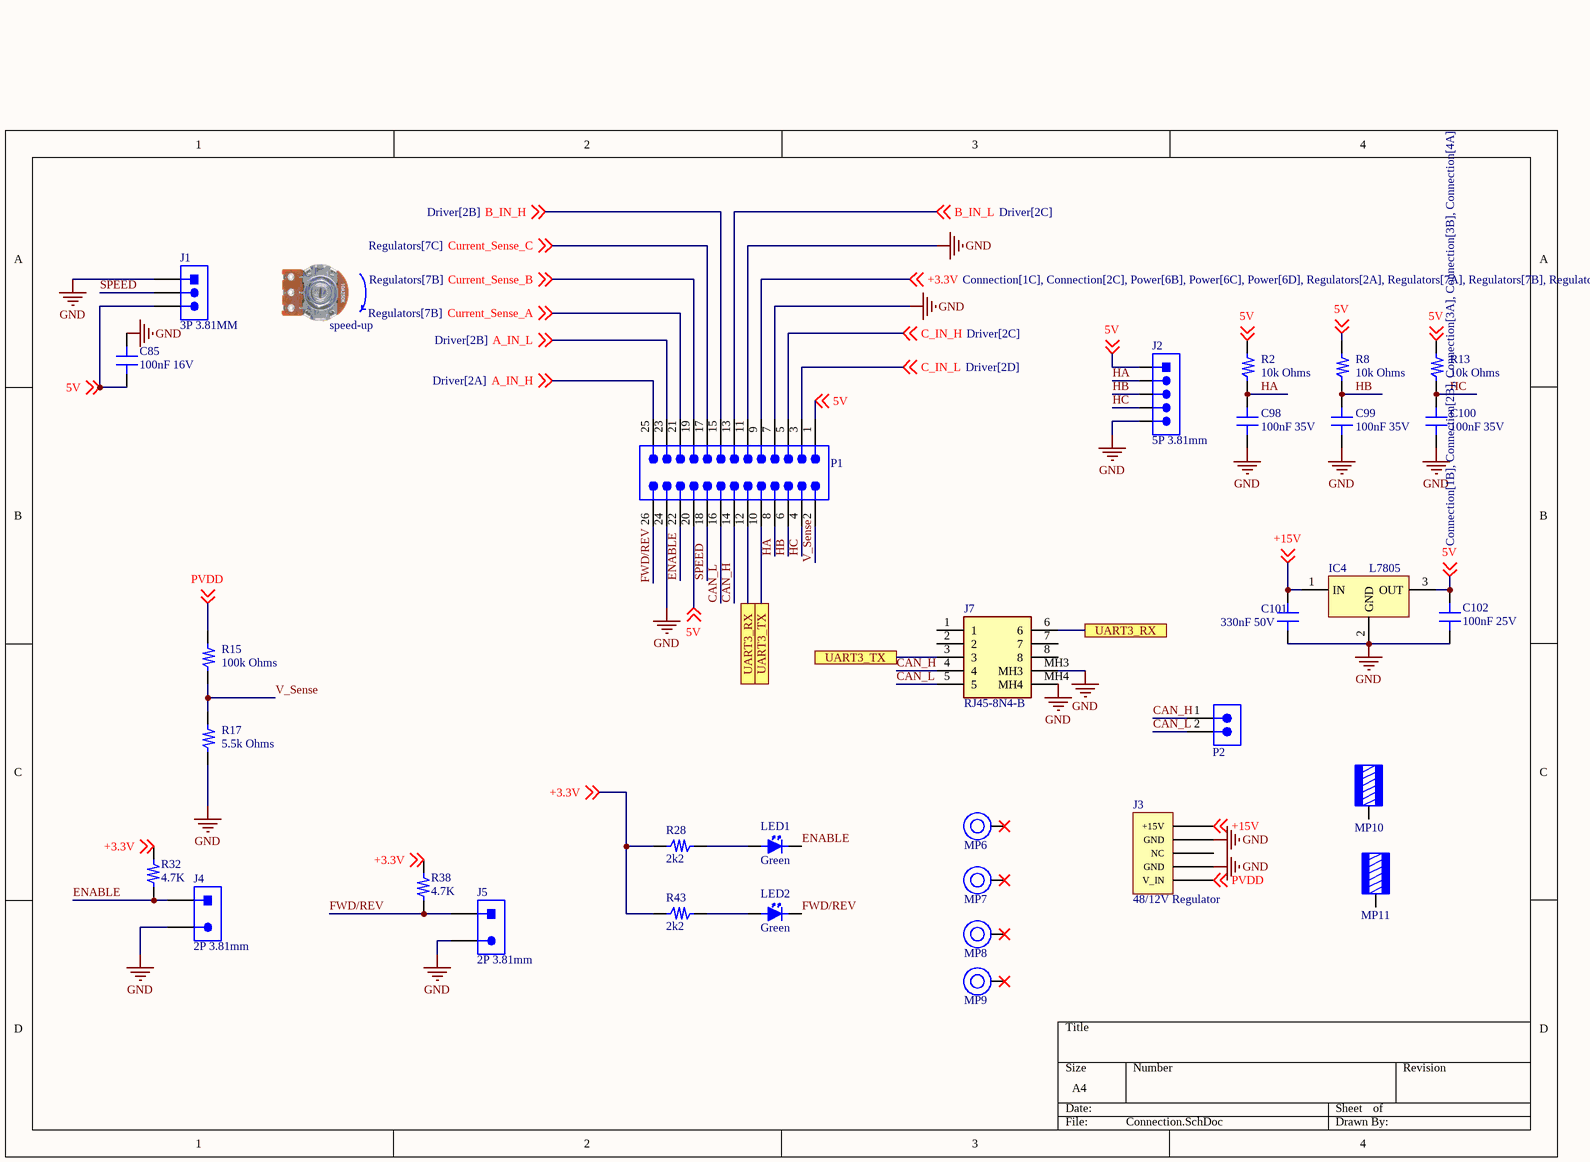
[diagram p3: Connection.SchDoc]

### Parts
C85  100nF 16V  [0805_CAP]
C98  100nF 35V  [0805_CAP]
C99  100nF 35V  [0805_CAP]
C100  100nF 35V  [0805_CAP]
C101  330nF 50V  [0805_CAP]
C102  100nF 25V  [0805_CAP]
IC4  L7805  [TO-220-3]
J1  3P 3.81MM  [TB3_3.81_90C]
J2  5P 3.81mm  [TB5 3.81MM]
J3  48/12V Regulator  [48/12V REGULATOR]
J4  2P 3.81mm  [TB2_3.81MM]
J5  2P 3.81mm  [TB2_3.81MM]
J7  RJ45-8N4-B  [RJ458N4B]
LED1  Green  [0805LED]
LED2  Green  [0805LED]
MP6  M3 x 11mm  [9774110360]  (value not drawn)
MP7  M3 x 11mm  [9774110360]  (value not drawn)
MP8  M3 x 11mm  [9774110360]  (value not drawn)
MP9  M3 x 11mm  [9774110360]  (value not drawn)
MP10  M3  [7466303]  (value not drawn)
MP11  M3  [7466303]  (value not drawn)
P1  61302621121  [61302621121]  (value not drawn)
P2  61300211121  [61300211121]  (value not drawn)
R2  10k Ohms  [0805_RES]
R8  10k Ohms  [0805_RES]
R13  10k Ohms  [0805_RES]
R15  100k Ohms  [0805_RES]
R17  5.5k Ohms  [0805_RES]
R28  2k2  [0603_RES]
R32  4.7K  [0603_RES]
R38  4.7K  [0603_RES]
R43  2k2  [0603_RES]

### Ports
UART3_RX (see Connection[2C]), UART3_RX (see Connection[3B]), UART3_TX (see Connection[2C]), UART3_TX (see Connection[3C])

### Nets
GND: C85.1 C98.1 C99.1 C100.1 C101.1 C102.1 IC4.2(GND) J1.1 J2.5 J3.2(GND) J3.4(GND) J4.2 J5.2 J7.MH3 J7.MH4 P1.7 P1.11 P1.24 R17.2
5V: C85.2 C102.2 IC4.3(OUT) J1.3 J2.1 P1.1 P1.20 R2.1 R8.1 R13.1 ; off-sheet 5V
+3.3V: P1.9 R28.1 R32.2 R38.2 R43.1 ; off-sheet +3.3V
+15V: C101.2 IC4.1(IN) J3.1(+15V) ; off-sheet +15V
A_IN_H: P1.25 ; off-sheet A_IN_H
A_IN_L: P1.23 ; off-sheet A_IN_L
B_IN_H: P1.15 ; off-sheet B_IN_H
B_IN_L: P1.13 ; off-sheet B_IN_L
C_IN_H: P1.5 ; off-sheet C_IN_H
C_IN_L: P1.3 ; off-sheet C_IN_L
CAN_H: J7.4 P1.14 P2.1
CAN_L: J7.5 P1.16 P2.2
Current_Sense_A: P1.21 ; off-sheet Current_Sense_A
Current_Sense_B: P1.19 ; off-sheet Current_Sense_B
Current_Sense_C: P1.17 ; off-sheet Current_Sense_C
ENABLE: J4.1 LED1.2(Cathode(-)) P1.22 R32.1
FWD/REV: J5.1 LED2.2(Cathode(-)) P1.26 R38.1
HA: C98.2 J2.2 P1.8 R2.2
HB: C99.2 J2.3 P1.6 R8.2
HC: C100.2 J2.4 P1.4 R13.2
PVDD: J3.5(V_IN) R15.1 ; off-sheet PVDD
SPEED: J1.2 P1.18
V_Sense: P1.2 R15.2 R17.1
NetJ7_3: J7.3 P1.10 ; port UART3_TX
NetJ7_6: J7.6 P1.12 ; port UART3_RX
NetLED1_1: LED1.1(Anode(+)) R28.2
NetLED2_1: LED2.1(Anode(+)) R43.2

Not connected (* = marked no-connect by the designer): J3 3(NC); J7 1 2 7 8; MP6 1*; MP7 1*; MP8 1*; MP9 1*; MP10 1; MP11 1

### Notes on the sheet
- speed-up

### Library data of the parts
C85 C98-C102 = CAP_0805
  C85: Value: 100nF 16V
  C98-C100: Value: 100nF 35V
  C101: Value: 330nF 50V
  C102: Value: 100nF 25V
IC4 = L7806: L7806CV-DG - IC-7806 V.REG.+5V 1.5A TO220 DOUBLE GAUGE ST; ComponentLink1Description: Özdisan; ComponentLink1URL: https://ozdisan.com/entegre-devreler-ics/guc-entegreleri/lineer-voltaj-regulatorleri/L7806CV-DG/5861; PartValue: L7805; ComponentLink2Description: Datasheet; ComponentLink2URL: https://cdn.ozdisan.com/ETicaret_Dosya/39226_7065362.pdf
J1 = TBLOCK3 3.81MM: 15EDGRC-3.81-03P-11-00AH - TERM.BLK.3.81MM 3P 90C MALE GRAY CLOSED; ComponentLink1Description: Özdisan; ComponentLink1URL: https://www.ozdisan.com/Product/Detail/515263/15EDGRC-3-81-03P-11-00AH; ComponentLink2Description: Datasheet; ComponentLink2URL: https://enoss.degson.com/upload/file/20210313/10030000179/15EDGRC-3.81-XXP-1Y-00A(H)T0-1.pdf
J2 = TBLOCK5 3.81MM: 15EDGRC-3.81-05P-14-00AH - TERM.BLK.3.81MM 5P 90C MALE GREEN CLOSED; ComponentLink1Description: Özdisan; ComponentLink1URL: https://www.ozdisan.com/konnektor-ve-baglanti-elemanlari/klemensler/gecmeli-klemensler/15EDGRC-3-81-05P-14-00AH; ComponentLink2Description: Datasheet; ComponentLink2URL: https://enoss.degson.com/upload/file/20210313/10030000179/15EDGRC-3.81-XXP-1Y-00A(H)T0-1.pdf
J3 = 48-12V REGULATOR
J4 J5 = TBLOCK2 3.81MM: 15EDGRC-3.81-02P-11-00AH - TERM.BLK.3.81MM 2P 90C MALE GRAY CLOSED; ComponentLink1Description: Özdisan; ComponentLink1URL: https://ozdisan.com/konnektor-ve-baglanti-elemanlari/klemensler/gecmeli-klemensler/15EDGRC-3-81-02P-11-00AH
J7 = RJ45-8N4-B: Modular Connectors / Ethernet Connectors 6 TRMN BRD/CBLE GRND 8 PIN BLOCK INDUCTOR; Manufacturer_Name: TE Connectivity; Geometry.Height: 13.58mm; Manufacturer_Part_Number: RJ45-8N4-B; Mouser Part Number: 592-RJ45-8N4-B; Mouser Price/Stock: https://www.mouser.co.uk/ProductDetail/TE-Connectivity-PB/RJ45-8N4-B?qs=LiYTmuET8LTUh2dcTsii4g%3D%3D; Arrow Part Number: *; Arrow Price/Stock: *; Datasheet Link: https://www.te.com/commerce/DocumentDelivery/DDEController?Action=showdoc&DocId=Catalog+Section%7F1654001_CORCOM_PRODUCT_GUIDE%7F0611%7Fpdf%7FEnglish%7FENG_CS_1654001_CORCOM_PRODUCT_GUIDE_0611.pdf%7F1-6609212-5
LED1 LED2 = LED: 0805
MP6-MP9 = 9774110360R: WA-SMSI SMT Steel Spacer with internal Thread, OD 6mm, M3 x 11mm; Manufacturer: Wurth Elektronik; Inside Diameter: 4.2mm; Surface: Tin; ComponentLink1Description: Website Link; ComponentLink1URL: https://www.we-online.com/redexpert/article/9774110360R?ad; ComponentLink2Description: Datasheet Link; ComponentLink2URL: https://www.we-online.com/redexpert/spec/9774110360R?ad; Manufacturer Part Number: 9774110360R; Category: SMT Spacers; Match Code: WA-SMSI; Mount: Surface Mount; Operating Temperature Max: 150°C; Operating Temperature Min: -55°C; Packaging: Tape and Reel; Height: 11mm; Material: Steel; Outside Diameter: 6mm; Thread Size: M3
MP10 MP11 = 7466303: WP-SMRA REDCUBE SMT Right Angled without pins, M3, 50A; Manufacturer: Wurth Elektronik; Surface: Tin; ComponentLink1Description: Website Link; ComponentLink1URL: https://www.we-online.com/redexpert/article/7466303?ad; ComponentLink2Description: Datasheet Link; ComponentLink2URL: https://www.we-online.com/redexpert/spec/7466303?ad; Manufacturer Part Number: 7466303; Category: REDCUBE SMT; Match Code: WP-SMRA; Mount: Surface Mount; Operating Temperature Max: 150°C; Operating Temperature Min: -55°C; Packaging: Bulk; Height: 5mm; Material: Brass; Rated Current: 50A; Thread Size: M3
P1 = 61302621121: WR-PHD Pin Header, THT, Vertical, pitch 2.54mm, 2 Row, 26P; Manufacturer: Wurth Elektronik; Contact Resistance: 20mΩ; Rated Current: 3A; Working Voltage: 250V; Withstanding Voltage: 500V; ComponentLink1Description: Website Link; ComponentLink1URL: https://www.we-online.com/redexpert/article/61302621121?ad; ComponentLink2Description: Datasheet Link; ComponentLink2URL: https://www.we-online.com/redexpert/spec/61302621121?ad; Manufacturer Part Number: 61302621121; Category: Board-to-Board Connectors; Match Code: WR-PHD; Mount: Through Hole; Operating Temperature Max: 105°C; Operating Temperature Min: -40°C; Packaging: Bag; Gender: Pin Header; Number of Pins: 26; Number of Rows: 2; Orientation: Vertical; Pitch: 2.54mm
P2 = 61300211121: WR-PHD Pin Header, THT, Vertical, pitch 2.54mm, 1 Row, 2P; Manufacturer: Wurth Elektronik; Contact Resistance: 20mOhm; Rated Current: 3A; Working Voltage: 250V; Withstanding Voltage: 500V; Manufacturer Part Number: 61300211121; Category: Board-to-Board Connectors; Match Code: WR-PHD; ComponentLink1Description: Website Link; ComponentLink1URL: https://www.we-online.com/redexpert/article/61300211121?ad; ComponentLink2Description: Datasheet Link; ComponentLink2URL: https://www.we-online.com/redexpert/spec/61300211121?ad; Mount: Through Hole; Operating Temperature Max: 105°C; Operating Temperature Min: -40°C; Packaging: Bag; Gender: Pin Header; Number of Pins: 2; Number of Rows: 1; Orientation: Vertical; Pitch: 2.54mm
R2 R8 R13 R15 R17 = RES_0805: 0805; Power: 1/8 W
  R2 R8 R13: Value: 10k Ohms
  R15: Value: 100k Ohms
  R17: Value: 5.5k Ohms
R28 R32 R38 R43 = RES_0603: 0603; Value: 0/10 Ohms; Power: 1/8W

## Nets that join several sheets
GND: Driver (33 pins), Power (10 pins), Regulators (39 pins), Connection (19 pins)
PGND: Power (52 pins), Regulators (MP5.1)
+3.3V: Power (6 pins), Regulators (9 pins), Connection (5 pins)
+5V: Driver (15 pins), Regulators (C73.2 C74.2 R85.1 U4.3)
+15V: Driver (9 pins), Regulators (7 pins), Connection (C101.2 IC4.1 J3.1)
A_IN_H: Driver (R6.1), Connection (P1.25)
A_IN_L: Driver (R12.1), Connection (P1.23)
B_IN_H: Driver (R21.1), Connection (P1.15)
B_IN_L: Driver (R27.1), Connection (P1.13)
C_IN_H: Driver (R36.1), Connection (P1.5)
C_IN_L: Driver (R42.1), Connection (P1.3)
COUT_A: Power (C51.2 R58.2), Regulators (U8.3)
COUT_B: Power (C61.2 R71.2), Regulators (U9.3)
COUT_C: Power (C71.2 R84.2), Regulators (U10.3)
Current_Sense_A: Regulators (U8.1 U8.4), Connection (P1.21)
Current_Sense_B: Regulators (U9.1 U9.4), Connection (P1.19)
Current_Sense_C: Regulators (U10.1 U10.4), Connection (P1.17)
ISO_+12_A_H: Driver (C12.1 C13.2 D1.K U1.16), Regulators (B1.5)
ISO_+12_A_L: Driver (C10.1 C11.2 U1.11), Regulators (B2.5)
ISO_+12_B_H: Driver (C26.1 C27.2 D6.K U2.16), Regulators (B3.5)
ISO_+12_B_L: Driver (C24.1 C25.2 U2.11), Regulators (B4.5)
ISO_+12_C_H: Driver (C40.1 C41.2 D11.K U3.16), Regulators (B6.5)
ISO_+12_C_L: Driver (C38.1 C39.2 U3.11), Regulators (B5.5)
ISO_-12_A_H: Driver (C12.2 C13.1 R4.1 U1.14), Power (Q1.2 Q1.3 Q2.2 Q2.3), Regulators (B1.4)
ISO_-12_A_L: Driver (R14.1), Regulators (B2.4)
ISO_-12_B_H: Driver (C26.2 C27.1 R19.1 U2.14), Power (Q7.2 Q7.3 Q8.2 Q8.3), Regulators (B3.4)
ISO_-12_B_L: Driver (R29.1), Regulators (B4.4)
ISO_-12_C_H: Driver (C40.2 C41.1 R34.1 U3.14), Power (Q13.2 Q13.3 Q14.2 Q14.3), Regulators (B6.4)
ISO_-12_C_L: Driver (R44.1), Regulators (B5.4)
kelvin 2: Driver (5 pins), Power (Q4.2 Q4.3 Q5.2 Q5.3)
kelvin 4: Driver (5 pins), Power (Q10.2 Q10.3 Q11.2 Q11.3)
kelvin 6: Driver (5 pins), Power (Q16.2 Q16.3 Q17.2 Q17.3)
Phase_A_H: Driver (R4.2 R5.2 R7.2), Power (R46.1 R47.1)
Phase_A_L: Driver (R9.2 R10.2 R11.1), Power (R52.1 R53.1)
Phase_B_H: Driver (R19.2 R20.2 R22.2), Power (R59.1 R60.1)
Phase_B_L: Driver (R24.2 R25.2 R26.1), Power (R65.1 R66.1)
Phase_C_H: Driver (R34.2 R35.2 R37.2), Power (R72.1 R73.1)
Phase_C_L: Driver (R39.2 R40.2 R41.1), Power (R78.1 R79.1)
PVDD: Power (39 pins), Regulators (MP4.1 R87.1), Connection (J3.5 R15.1)